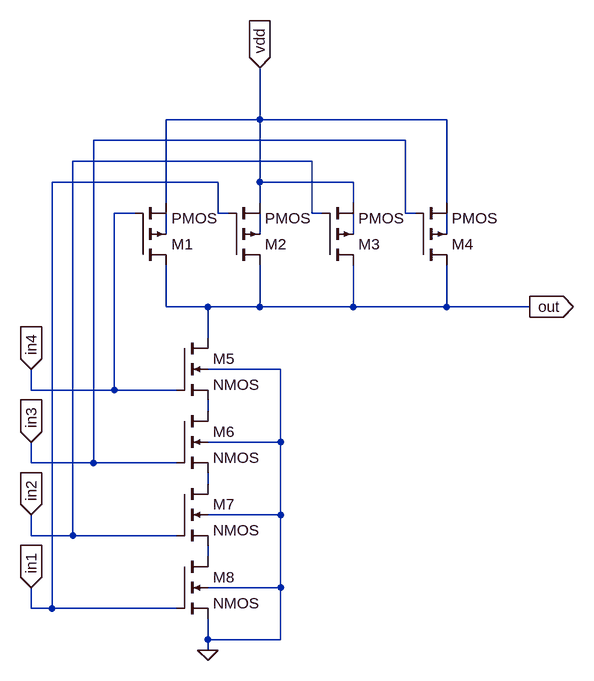
[diagram p0: schematic nand4.asc]
nand4.asc, the LTspice schematic file:
Version 4
SHEET 1 880 740
WIRE 176 -96 176 -176
WIRE 176 -96 32 -96
WIRE 464 -96 176 -96
WIRE 400 -64 -80 -64
WIRE 256 -32 -112 -32
WIRE 112 0 -144 0
WIRE 176 0 176 -96
WIRE 320 0 176 0
WIRE 32 32 32 -96
WIRE 176 32 176 0
WIRE 320 32 320 0
WIRE 464 32 464 -96
WIRE -16 48 -48 48
WIRE 112 48 112 0
WIRE 128 48 112 48
WIRE 256 48 256 -32
WIRE 272 48 256 48
WIRE 400 48 400 -64
WIRE 416 48 400 48
WIRE 32 80 32 48
WIRE 176 80 176 48
WIRE 320 80 320 48
WIRE 464 80 464 48
WIRE 32 192 32 128
WIRE 96 192 32 192
WIRE 176 192 176 128
WIRE 176 192 96 192
WIRE 320 192 320 128
WIRE 320 192 176 192
WIRE 464 192 464 128
WIRE 464 192 320 192
WIRE 592 192 464 192
WIRE 96 240 96 192
WIRE 208 288 96 288
WIRE -176 320 -176 288
WIRE -48 320 -48 48
WIRE -48 320 -176 320
WIRE 48 320 -48 320
WIRE 96 352 96 336
WIRE 208 400 208 288
WIRE 208 400 96 400
WIRE -176 432 -176 400
WIRE -80 432 -80 -64
WIRE -80 432 -176 432
WIRE 48 432 -80 432
WIRE 96 464 96 448
WIRE 208 512 208 400
WIRE 208 512 96 512
WIRE -176 544 -176 512
WIRE -112 544 -112 -32
WIRE -112 544 -176 544
WIRE 48 544 -112 544
WIRE 96 576 96 560
WIRE 208 624 208 512
WIRE 208 624 96 624
WIRE -176 656 -176 624
WIRE -144 656 -144 0
WIRE -144 656 -176 656
WIRE 48 656 -144 656
WIRE 96 704 96 672
WIRE 208 704 208 624
WIRE 208 704 96 704
WIRE 96 720 96 704
FLAG -176 624 in1
IOPIN -176 624 In
FLAG -176 512 in2
IOPIN -176 512 In
FLAG -176 400 in3
IOPIN -176 400 In
FLAG -176 288 in4
IOPIN -176 288 In
FLAG 96 720 0
FLAG 176 -176 vdd
IOPIN 176 -176 In
FLAG 592 192 out
IOPIN 592 192 Out
SYMBOL pmos4 -16 128 M180
SYMATTR InstName M1
SYMATTR Value2 l=90n w=400n
SYMBOL pmos4 128 128 M180
SYMATTR InstName M2
SYMATTR Value2 l=90n w=400n
SYMBOL pmos4 272 128 M180
SYMATTR InstName M3
SYMATTR Value2 l=90n w=400n
SYMBOL pmos4 416 128 M180
SYMATTR InstName M4
SYMATTR Value2 l=90n w=400n
SYMBOL nmos4 48 240 R0
SYMATTR InstName M5
SYMATTR Value2 l=90n w=200n
SYMBOL nmos4 48 352 R0
SYMATTR InstName M6
SYMATTR Value2 l=90n w=200n
SYMBOL nmos4 48 464 R0
SYMATTR InstName M7
SYMATTR Value2 l=90n w=200n
SYMBOL nmos4 48 576 R0
SYMATTR InstName M8
SYMATTR Value2 l=90n w=200n

The netlist it stands for:
* nand4.asc
M1 out in4 vdd N001 PMOS l=90n w=400n
M2 out in1 vdd N002 PMOS l=90n w=400n
M3 out in2 vdd N003 PMOS l=90n w=400n
M4 out in3 vdd N004 PMOS l=90n w=400n
M5 out in4 N005 0 NMOS l=90n w=200n
M6 N005 in3 N006 0 NMOS l=90n w=200n
M7 N006 in2 N007 0 NMOS l=90n w=200n
M8 N007 in1 0 0 NMOS l=90n w=200n
.model NMOS NMOS
.model PMOS PMOS
.lib standard.mos
.backanno
.end